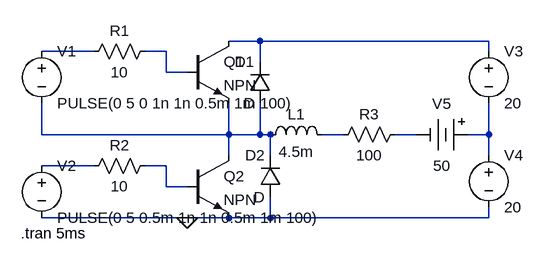
[diagram p0: schematic Inverter_RLE.asc]
Inverter_RLE.asc, the LTspice schematic file:
Version 4
SHEET 1 936 680
WIRE 480 144 432 144
WIRE 832 144 480 144
WIRE 224 160 144 160
WIRE 336 160 304 160
WIRE 832 160 832 144
WIRE 480 176 480 144
WIRE 336 192 336 160
WIRE 368 192 336 192
WIRE 144 288 144 240
WIRE 432 288 432 240
WIRE 432 288 144 288
WIRE 480 288 480 240
WIRE 480 288 432 288
WIRE 496 288 480 288
WIRE 608 288 576 288
WIRE 720 288 688 288
WIRE 832 288 832 240
WIRE 832 288 800 288
WIRE 432 320 432 288
WIRE 496 320 496 288
WIRE 832 320 832 288
WIRE 224 336 144 336
WIRE 336 336 304 336
WIRE 336 368 336 336
WIRE 368 368 336 368
WIRE 368 416 144 416
WIRE 432 416 368 416
WIRE 496 416 496 384
WIRE 496 416 432 416
WIRE 832 416 832 400
WIRE 832 416 496 416
FLAG 368 416 0
SYMBOL res 320 144 R90
WINDOW 0 0 56 VBottom 2
WINDOW 3 32 56 VTop 2
SYMATTR InstName R1
SYMATTR Value 10
SYMBOL res 320 320 R90
WINDOW 0 0 56 VBottom 2
WINDOW 3 32 56 VTop 2
SYMATTR InstName R2
SYMATTR Value 10
SYMBOL voltage 144 144 R0
WINDOW 123 0 0 Left 0
WINDOW 39 0 0 Left 0
SYMATTR InstName V1
SYMATTR Value PULSE(0 5 0 1n 1n 0.5m 1m 100)
SYMBOL voltage 144 320 R0
WINDOW 123 0 0 Left 0
WINDOW 39 0 0 Left 0
SYMATTR InstName V2
SYMATTR Value PULSE(0 5 0.5m 1n 1n 0.5m 1m 100)
SYMBOL voltage 832 144 R0
WINDOW 123 0 0 Left 0
WINDOW 39 0 0 Left 0
SYMATTR InstName V3
SYMATTR Value 20
SYMBOL voltage 832 304 R0
WINDOW 123 0 0 Left 0
WINDOW 39 0 0 Left 0
SYMATTR InstName V4
SYMATTR Value 20
SYMBOL npn 368 144 R0
SYMATTR InstName Q1
SYMBOL npn 368 320 R0
SYMATTR InstName Q2
SYMBOL diode 496 240 R180
WINDOW 0 24 64 Left 2
WINDOW 3 24 0 Left 2
SYMATTR InstName D1
SYMBOL diode 512 384 R180
WINDOW 0 24 64 Left 2
WINDOW 3 24 0 Left 2
SYMATTR InstName D2
SYMBOL ind 480 304 R270
WINDOW 0 32 56 VTop 2
WINDOW 3 5 56 VBottom 2
SYMATTR InstName L1
SYMATTR Value 4.5m
SYMBOL res 704 272 R90
WINDOW 0 0 56 VBottom 2
WINDOW 3 32 56 VTop 2
SYMATTR InstName R3
SYMATTR Value 100
SYMBOL Misc/battery 816 288 R90
WINDOW 0 -32 56 VBottom 2
WINDOW 3 32 56 VTop 2
SYMATTR InstName V5
SYMATTR Value 50
TEXT 112 440 Left 2 !.tran 5ms

The netlist it stands for:
* Inverter_RLE.asc
R1 N003 N002 10
R2 N009 N008 10
V1 N002 N004 PULSE(0 5 0 1n 1n 0.5m 1m 100)
V2 N008 0 PULSE(0 5 0.5m 1n 1n 0.5m 1m 100)
V3 N001 N007 20
V4 N007 0 20
Q1 N001 N003 N004 0 NPN
Q2 N004 N009 0 0 NPN
D1 N004 N001 D
D2 0 N004 D
L1 N004 N005 4.5m
R3 N006 N005 100
V5 N007 N006 50
.model D D
.lib standard.dio
.model NPN NPN
.model PNP PNP
.lib standard.bjt
.tran 5ms
.backanno
.end